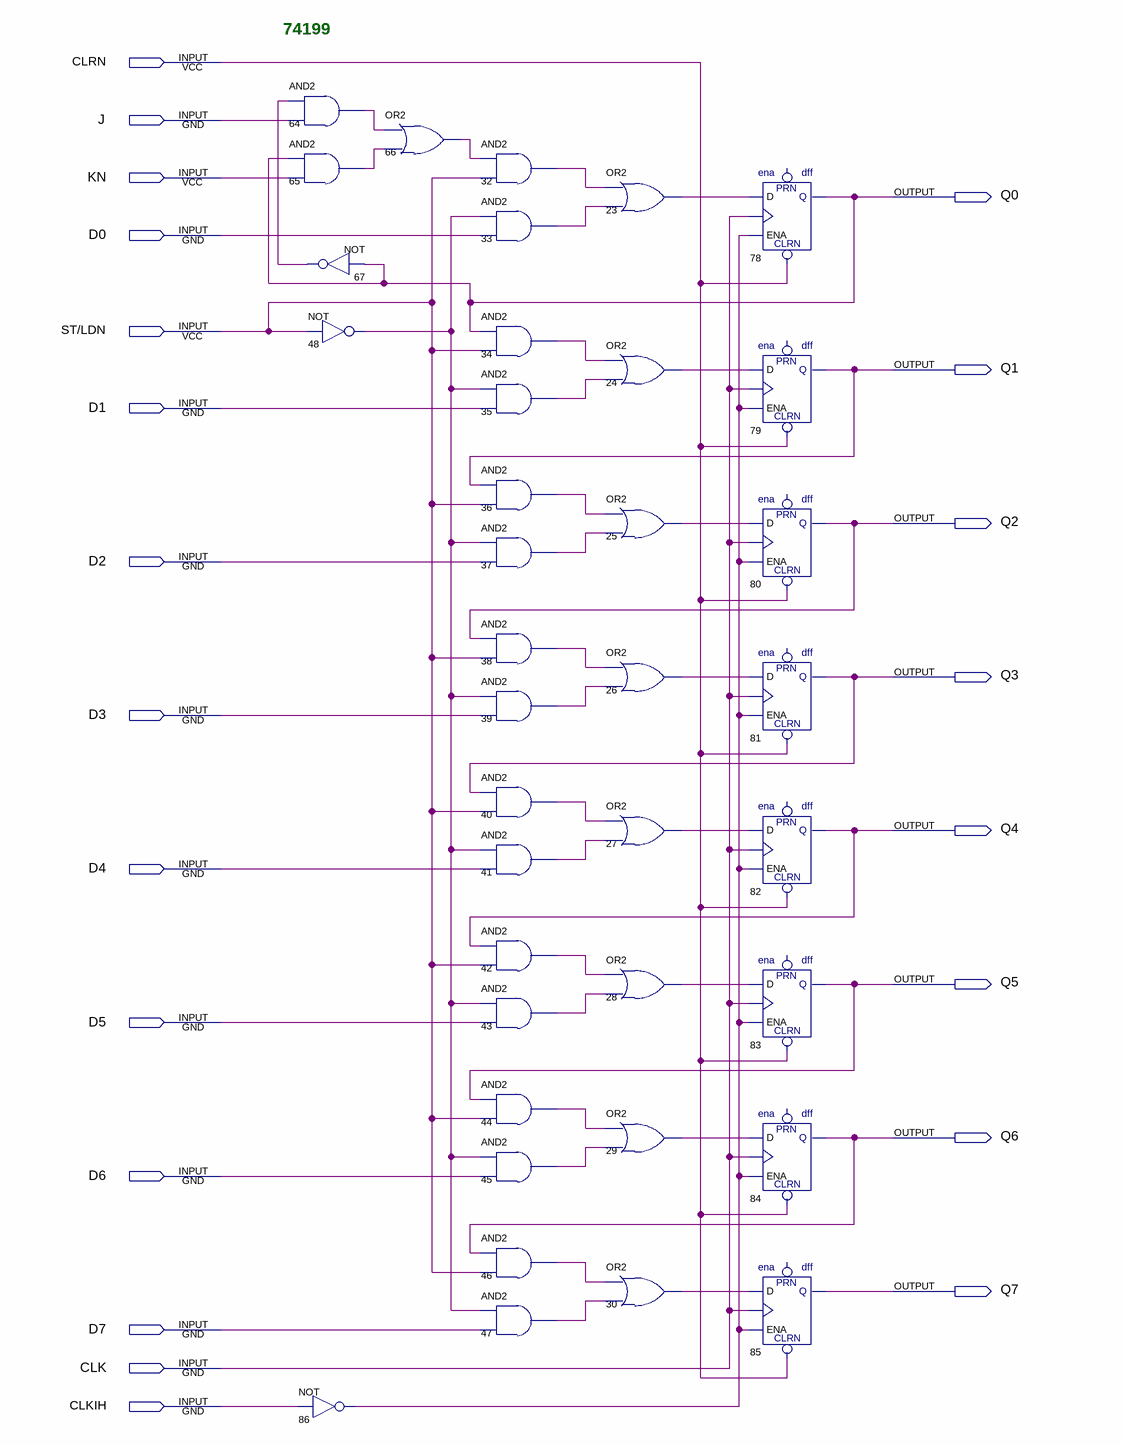
[diagram p0: schematic sheet]
// Quartus schematic 74199.bdf as structural Verilog: 38 symbols, 22 pins
module \74199  (
  input  CLRN,
  input  J,
  input  KN,
  input  D0,
  input  \ST/LDN ,
  input  D1,
  input  D2,
  input  D3,
  input  D4,
  input  D5,
  input  D6,
  input  D7,
  input  CLK,
  input  CLKIH,
  output Q0,
  output Q1,
  output Q2,
  output Q3,
  output Q4,
  output Q5,
  output Q6,
  output Q7
);

  wire n23_out, n24_out, n25_out, n26_out, n27_out, n28_out, n29_out, n30_out, n32_out, n33_out, n34_out,
       n35_out, n36_out, n37_out, n38_out, n39_out, n40_out, n41_out, n42_out, n43_out, n44_out, n45_out,
       n46_out, n47_out, n48_out, n64_out, n65_out, n66_out, n67_out, n86_out;

  and u_64 (n64_out, n67_out, J);
  and u_65 (n65_out, Q0, KN);
  not u_86 (n86_out, CLKIH);
  not u_67 (n67_out, Q0);
  not u_48 (n48_out, \ST/LDN );
  or u_66 (n66_out, n64_out, n65_out);
  and u_32 (n32_out, n66_out, \ST/LDN );
  and u_33 (n33_out, n48_out, D0);
  and u_34 (n34_out, Q0, \ST/LDN );
  and u_35 (n35_out, n48_out, D1);
  and u_36 (n36_out, Q1, \ST/LDN );
  and u_37 (n37_out, n48_out, D2);
  and u_38 (n38_out, Q2, \ST/LDN );
  and u_39 (n39_out, n48_out, D3);
  and u_40 (n40_out, Q3, \ST/LDN );
  and u_41 (n41_out, n48_out, D4);
  and u_42 (n42_out, Q4, \ST/LDN );
  and u_43 (n43_out, n48_out, D5);
  and u_44 (n44_out, Q5, \ST/LDN );
  and u_45 (n45_out, n48_out, D6);
  and u_46 (n46_out, Q6, \ST/LDN );
  and u_47 (n47_out, n48_out, D7);
  or u_23 (n23_out, n32_out, n33_out);
  or u_24 (n24_out, n34_out, n35_out);
  or u_25 (n25_out, n36_out, n37_out);
  or u_26 (n26_out, n38_out, n39_out);
  or u_27 (n27_out, n40_out, n41_out);
  or u_28 (n28_out, n42_out, n43_out);
  or u_29 (n29_out, n44_out, n45_out);
  or u_30 (n30_out, n46_out, n47_out);
  enadff u_78 (.ENA(n86_out), .D(n23_out), .CLRN(CLRN), .CLK(CLK), .Q(Q0));  // open: PRN
  enadff u_79 (.ENA(n86_out), .D(n24_out), .CLRN(CLRN), .CLK(CLK), .Q(Q1));  // open: PRN
  enadff u_80 (.ENA(n86_out), .D(n25_out), .CLRN(CLRN), .CLK(CLK), .Q(Q2));  // open: PRN
  enadff u_81 (.ENA(n86_out), .D(n26_out), .CLRN(CLRN), .CLK(CLK), .Q(Q3));  // open: PRN
  enadff u_82 (.ENA(n86_out), .D(n27_out), .CLRN(CLRN), .CLK(CLK), .Q(Q4));  // open: PRN
  enadff u_83 (.ENA(n86_out), .D(n28_out), .CLRN(CLRN), .CLK(CLK), .Q(Q5));  // open: PRN
  enadff u_84 (.ENA(n86_out), .D(n29_out), .CLRN(CLRN), .CLK(CLK), .Q(Q6));  // open: PRN
  enadff u_85 (.ENA(n86_out), .D(n30_out), .CLRN(CLRN), .CLK(CLK), .Q(Q7));  // open: PRN

  // Notes on the sheet:
  //   74199
endmodule
